# EasyEDA Pro project PWM.eprj

# Schematic Schematic1
Create Date: 2024-06-18; Page Name: P1; Project Name: PWM; Schematic Name: Schematic1; Update Date: 2024-06-20; Company: 嘉立创EDA; Page Size: A4; Version: V1.0
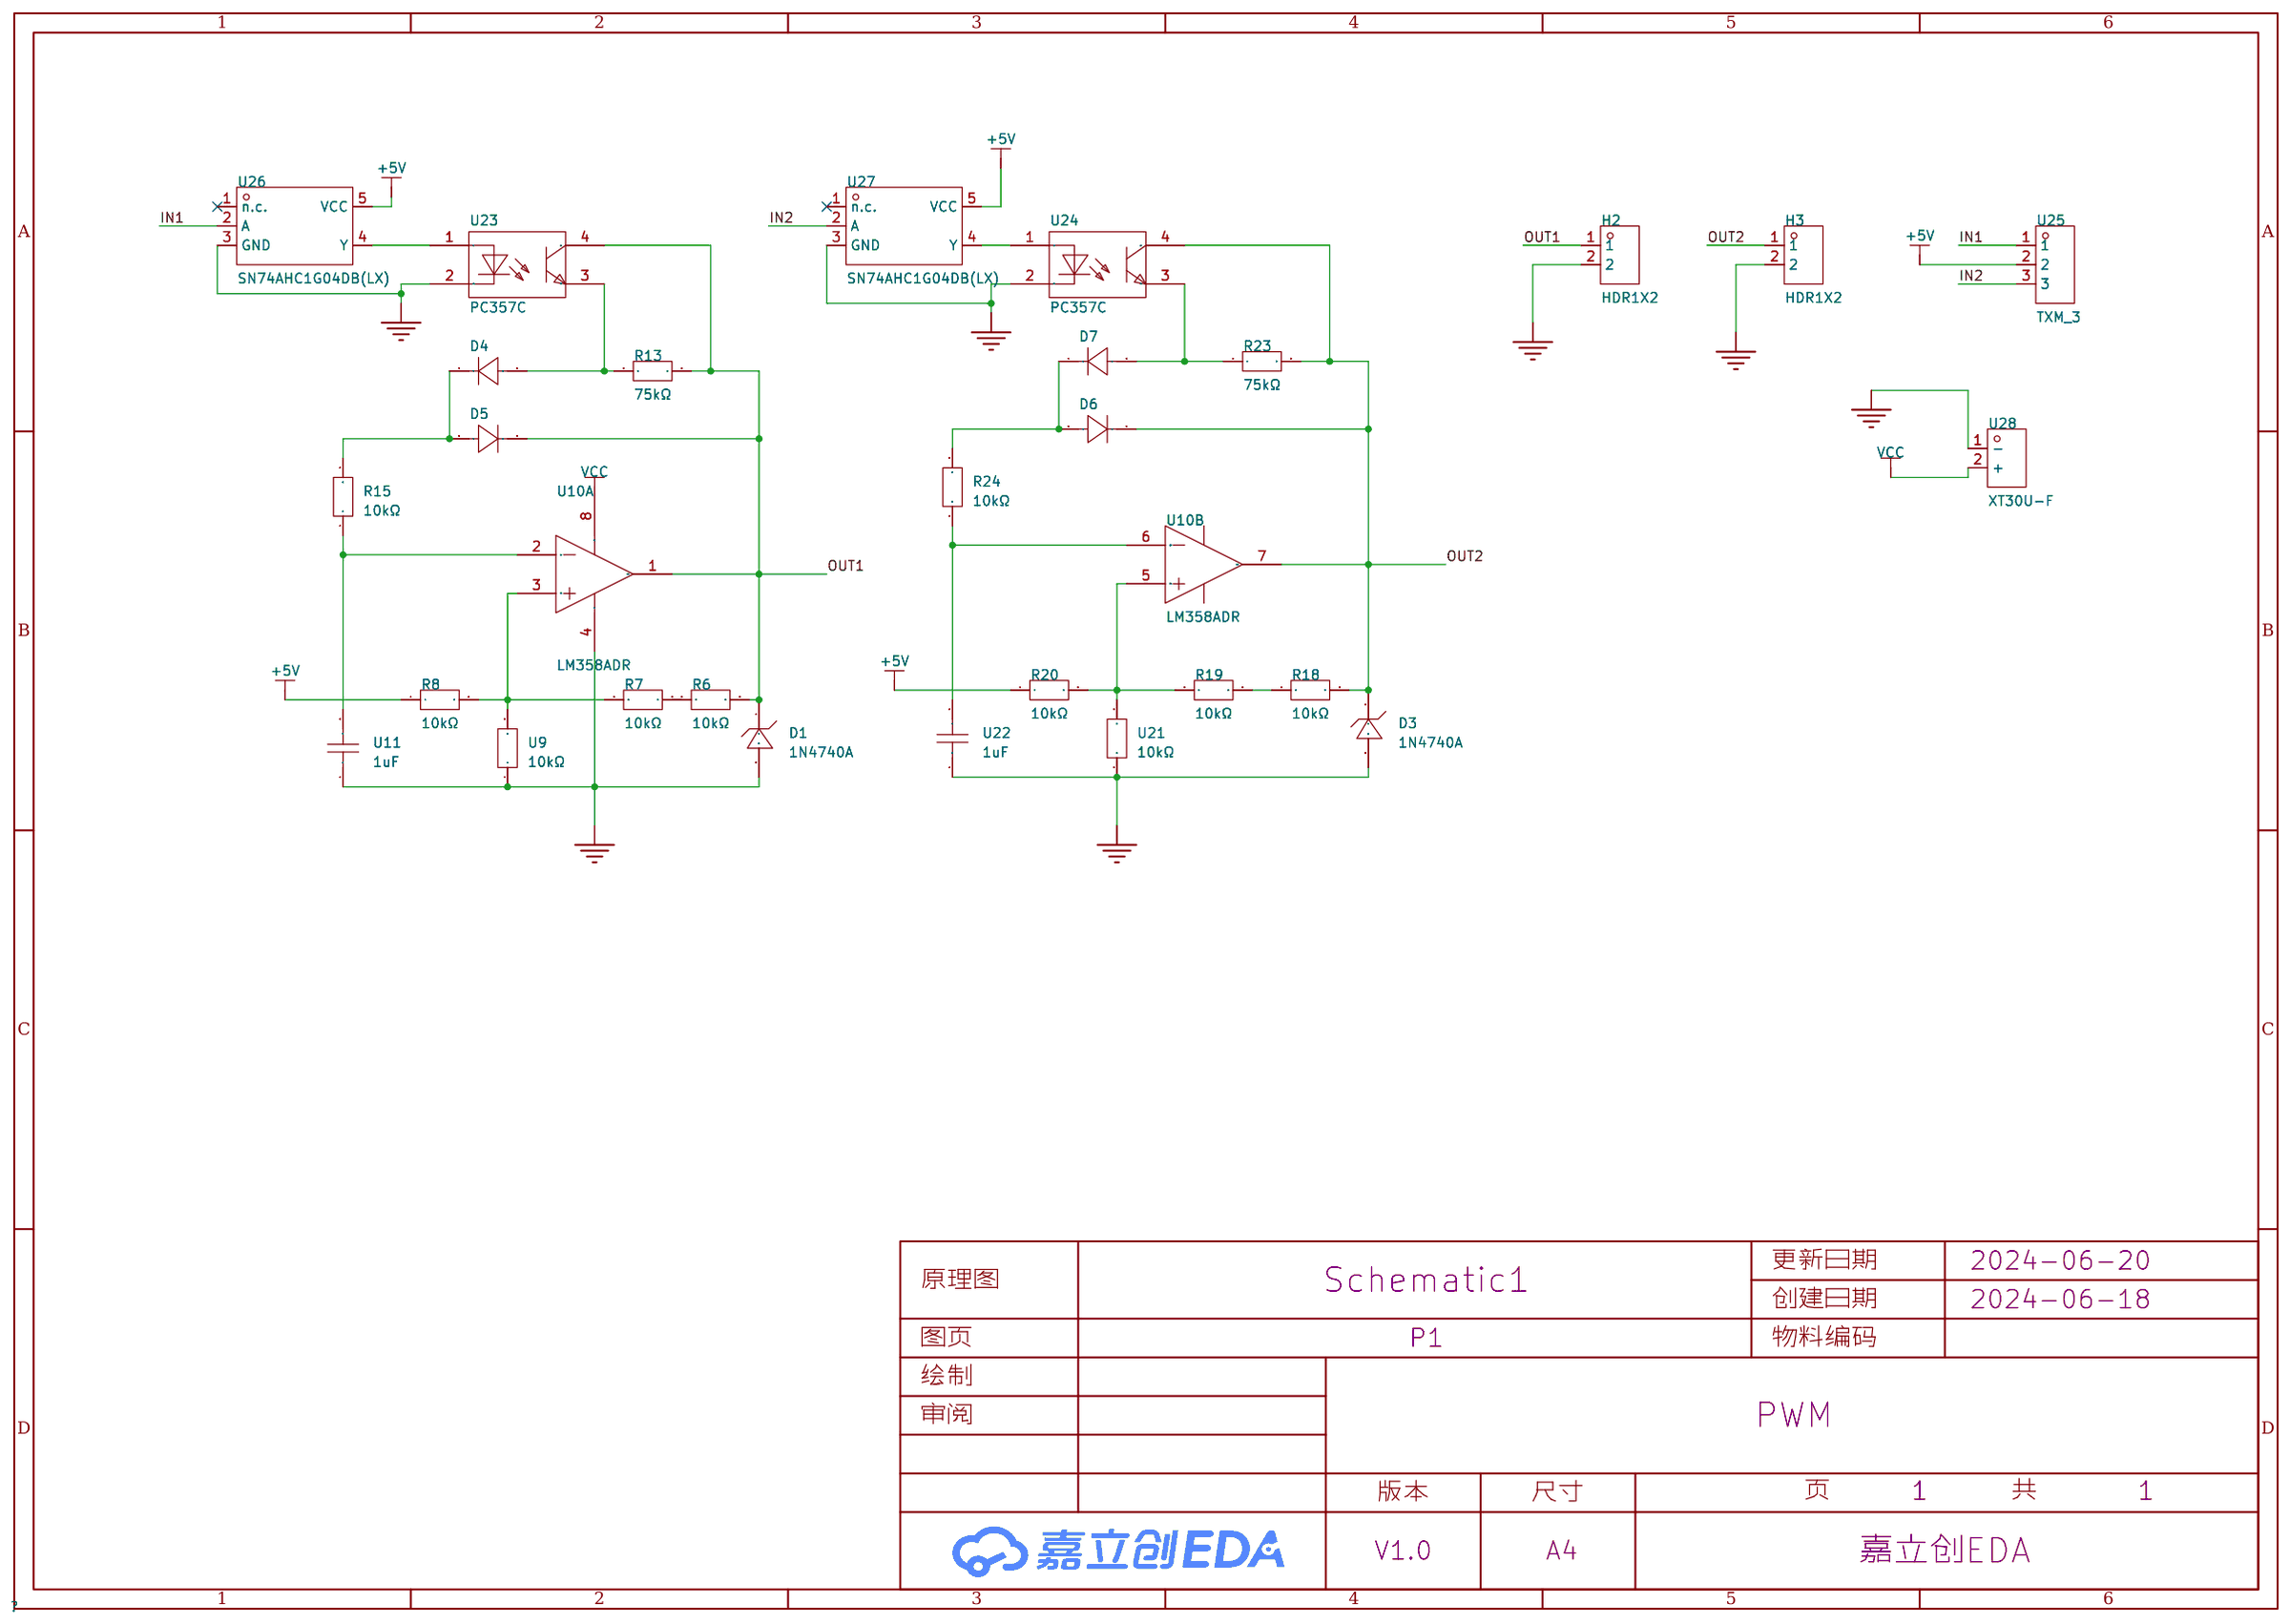
[diagram p0: schematic sheet]

## Parts
D1  1N4740A  [DO-41_BD2.4-L4.7-P8.70-D0.9-RD]
D3  1N4740A  [DO-41_BD2.4-L4.7-P8.70-D0.9-RD]
D4  -  [SMA_1N4007]
D5  -  [SMA_1N4007]
D6  -  [SMA_1N4007]
D7  -  [SMA_1N4007]
H2  HDR1X2  [HDR-TH_2P-P2.54-V-M-1]
H3  HDR1X2  [HDR-TH_2P-P2.54-V-M-1]
R6  10kΩ  [R0603]
R7  10kΩ  [R0603]
R8  10kΩ  [R0603]
R13  75kΩ  [R0805]
R15  10kΩ  [R0603]
R18  10kΩ  [R0603]
R19  10kΩ  [R0603]
R20  10kΩ  [R0603]
R23  75kΩ  [R0805]
R24  10kΩ  [R0603]
U9  10kΩ  [R0603]
U10  LM358ADR  [SOP-8_L4.9-W3.9-P1.27-LS6.0-BL]  (sections 1,2)
U11  1uF  [C0603]
U21  10kΩ  [R0603]
U22  1uF  [C0603]
U23  PC357C  [SOP-4_L4.6-W4.4-P2.54-LS7.0-TL]
U24  PC357C  [SOP-4_L4.6-W4.4-P2.54-LS7.0-TL]
U25  TXM_3  [HDR-TH_3P-P2.54-V-M-A]
U26  SN74AHC1G04DB(LX)  [SOT-23-5_L2.9-W1.6-P0.95-LS2.8-BR]
U27  SN74AHC1G04DB(LX)  [SOT-23-5_L2.9-W1.6-P0.95-LS2.8-BR]
U28  XT30U-F  [CONN-TH_XT30U-F]

## Library data of the parts
D1 D3 = 1N4740A: 二极管配置:独立式;稳压值(标称值):10V;功率(Pd):1W;; Supplier Part: C194121; Manufacturer: Multicomp; Supplier Footprint: DO-41; JLCPCB Part Class: 扩展库; Datasheet: https://atta.szlcsc.com/upload/public/pdf/source/20180713/C194121_FB04E48A62DB566CD3790F4CF10AE5FC.pdf; Supplier: LCSC; Diode Configuration: 独立式; Zener Voltage (Nom): 10V; Reverse Leakage Current (Ir): 10uA@7.6V; Power Dissipation: 1W; Zener Impedance (Zzt): 7Ω
D4-D7 = D_1N4007: Supplier Footprint: SMA
H2 H3 = HDR1X2: Supplier Part: C9900014921; Supplier Footprint: 排针; JLCPCB Part Class: 扩展库; Supplier: LCSC
R6-R8 R15 R18-R20 R24 U9 U21 = RCA0310KJLF: 阻值:10kΩ;精度:±5%;功率:100mW;; LCSC Part Name: 10kΩ ±5% 100mW; Supplier Part: C22369937; Manufacturer: HKR(香港电阻); Supplier Footprint: 0603; JLCPCB Part Class: 扩展库; Datasheet: https://atta.szlcsc.com/upload/public/pdf/source/20240327/626E23E3B2A799D2C85303DE2C37BB2A.pdf; Supplier: LCSC; Tolerance: ±5%; Power(Watts): 100mW
R13 R23 = WF08U7502DTL: 电阻类型:薄膜电阻;阻值:75kΩ;精度:±0.5%;功率:100mW;最大工作电压:100V;温度系数:±25ppm/℃;; LCSC Part Name: 薄膜电阻 75kΩ ±0.5% 100mW; Supplier Part: C880790; Manufacturer: Walsin(华新科); Supplier Footprint: 0805; JLCPCB Part Class: 扩展库; Datasheet: https://atta.szlcsc.com/upload/public/pdf/source/20180929/C305266_98C90C4B86D2D931B3D034C2E9BEFC81.pdf; Supplier: LCSC; Type: 薄膜电阻; Tolerance: ±0.5%; Power(Watts): 100mW; Overload Voltage (Max): 100V; Temperature Coefficient: ±25ppm/℃; Operating Temperature Range: -55℃~+155℃
U10 = LM358ADR_C404320: 放大器数:-;; Supplier Part: C404320; Manufacturer: UMW(友台半导体); Supplier Footprint: SOP-8; JLCPCB Part Class: 扩展库; Datasheet: https://atta.szlcsc.com/upload/public/pdf/source/20231109/C087AE3C5A972B772B4D5C149AD53864.pdf; Supplier: LCSC
U11 U22 = HGC0603R5105K250NTHJ: 容值:1uF;精度:±10%;额定电压:25V;材质(温度系数):X5R;; LCSC Part Name: 1uF ±10% 25V; Supplier Part: C7432766; Manufacturer: Chinocera(华瓷); Supplier Footprint: 0603; Datasheet: https://atta.szlcsc.com/upload/public/pdf/source/20240320/FAC3FEC40A78BC5CCCE96C232A94D860.pdf; Supplier: LCSC; Tolerance: ±10%; Voltage Rated: 25V; Temperature Coefficient: X5R
U23 U24 = PC357C_1: 输入电压类型:DC;正向电压:1.4V;输出电流:50mA;隔离电压(rms):3.75kV;反向电压:6V;输出通道数:1;集射极饱和电压(Vce(sat)@Ic,IF):200mV@1mA,20mA;; LCSC Part Name: 光耦-光电晶体管输出; Supplier Part: C20612582; Manufacturer: AOTE(奥特); Supplier Footprint: SOP-4; JLCPCB Part Class: 扩展库; Datasheet: https://atta.szlcsc.com/upload/public/pdf/source/20240430/5A81F6B402555EE96B4DF8FFE69D8124.pdf; Supplier: LCSC; Input voltage type: DC; Forward Voltage: 1.4V; Output Current: 50mA; Isolation Voltage(rms): 3.75kV; Reverse Voltage: 6V; Number of Outputs: 1; Collector-Emitter Saturation Voltage (Vce(sat)@Ic,IF): 200mV@1mA,20mA; Operating Temperature: -55℃~+100℃
U25 = TXM_3: Supplier Part: C9900014923; Supplier Footprint: 排针; JLCPCB Part Class: 扩展库; Supplier: LCSC
U26 U27 = SN74AHC1G04DB(LX): 电源电压:2V~5.5V;供电电流(最大值):1uA;电路数:1;最大传播延迟(tpd):7.5ns@5.5V,50pF;; LCSC Part Name: 集成电路; Supplier Part: C22384791; Manufacturer: LX(灵星芯微); Supplier Footprint: SOT-23-5; Datasheet: https://atta.szlcsc.com/upload/public/pdf/source/20240417/EB39B72976109D8FD4B2BA0D56E9CF3F.pdf; Supplier: LCSC; Supply Voltage(Single): 2V~5.5V; Supply Current (Max): 1uA; Number of Circuits: 1; Sink Current: 8mA; Source Current: 8mA; High level range (VIH): 1.5V~3.85V; Low level range (VIL): 500mV~1.65V; High level range (VOH): 1.9V~4.5V; Low level range (VOL): 100mV~360mV; Max Propagation Delay: 7.5ns@5.5V,50pF; Series: 74AHC系列; Operating Temperature: -40℃~+125℃
U28 = XT30U-F: 类别:-;类型1:-;; LCSC Part Name: AMASS(艾迈斯)轻量版锂电池插头母头 XT30U-F; Supplier Part: C99102; Manufacturer: AMASS(艾迈斯); JLCPCB Part Class: 扩展库; Datasheet: https://atta.szlcsc.com/upload/public/pdf/source/20190916/C428721_B0ECB8C5937139CEFE8736D2D3175B0E.pdf; Supplier: LCSC; Brand: 艾迈斯; Type: 插头; Colour: 黄色; InterfaceType: 母头

## Nets
+5V: R8.1 R20.1 U25.2 U26.5(VCC) U27.5(VCC)
GND: D1.2 D3.2 H2.2 H3.2 U9.1 U10.4(-V) U11.1 U21.1 U22.1 U23.2(CAT) U24.2(CAT) U26.3(GND) U27.3(GND) U28.1(-)
VCC: U10.8(+V) U28.2(+)
IN1: U25.1 U26.2(A)
IN2: U25.3 U27.2(A)
OUT1: D1.1 D5.1(K) H2.1 R6.2 R13.2 U10.1(OUT A) U23.4(COL)
OUT2: D3.1 D6.1(K) H3.1 R18.2 R23.2 U10.7(OUT B) U24.4(COL)
$1N1467: R6.1 R7.2
$1N1677: D4.1(K) D5.2(A) R15.2
$1N1702: R15.1 U10.2(-IN A) U11.2
$1N2156: R18.1 R19.2
$1N2172: D6.2(A) D7.1(K) R24.2
$1N2176: R24.1 U10.6(-IN B) U22.2
$1N3269: D7.2(A) R23.1 U24.3(EM)
$1N3293: D4.2(A) R13.1 U23.3(EM)
$1N4036: R7.1 R8.2 U9.2 U10.3(+IN A)
$1N4061: R19.1 R20.2 U10.5(+IN B) U21.2
$1N4283: U23.1(AN) U26.4(Y)
$1N4351: U24.1(AN) U27.4(Y)

Not connected (* = marked no-connect by the designer): U26 1(n.c.)*; U27 1(n.c.)*

# Board PCB1
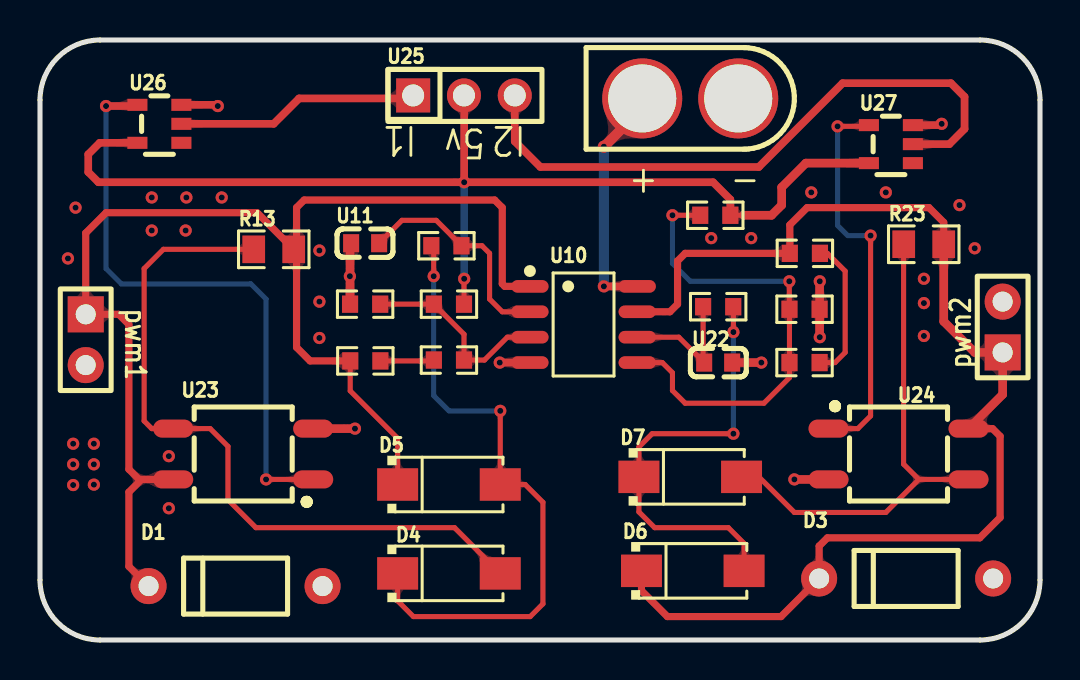
[diagram p1: board, top side]
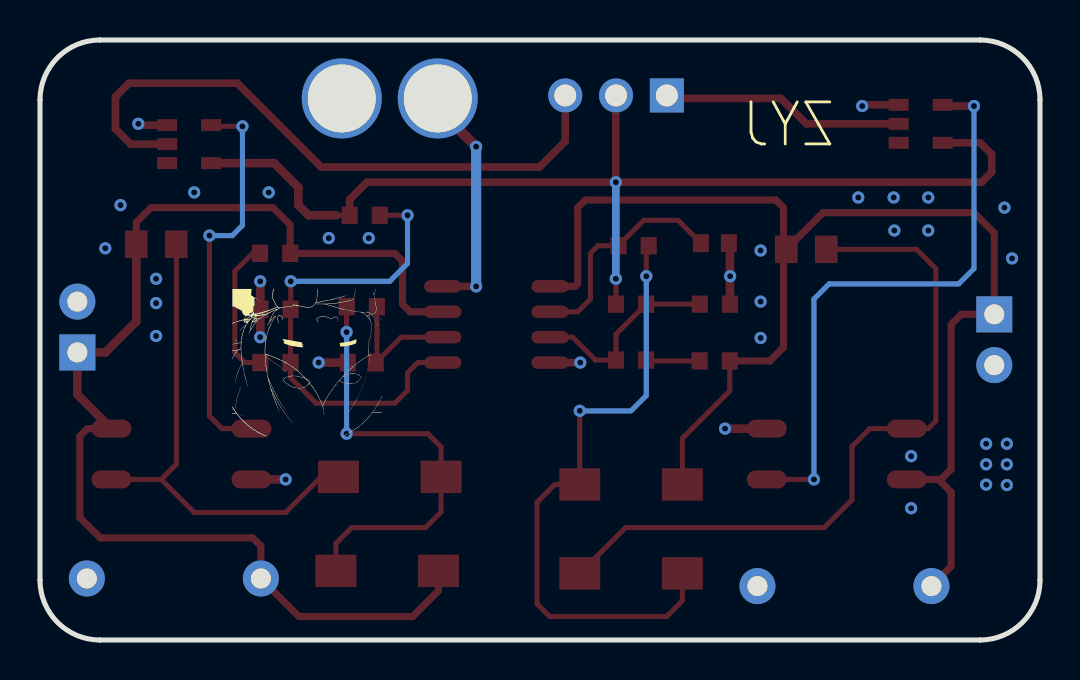
[diagram p2: board, bottom side, seen from below]

Outline 50 x 30 mm; copper layers: Top Layer, Bottom Layer. Coordinates in mm from the lower left corner of the outline.
Outline path: 0,27 0,3 arc(0.88,0.88) 3,0 47,0 arc(49.12,0.88) 50,3 50,27 arc(49.12,29.12) 47,30 3,30 arc(0.88,29.12) 0,27
Stack: Top Layer 0.035mm / Dielectric1 1.51mm FR4 er 4.5 / Bottom Layer 0.035mm

## Design rules (mm)
template: JLCPCB Capability(Two Layers Board)
spacing copperThickness1oz (default): track to track 0.102, other pairs 0.152 to 0.3
spacing copperThickness2oz: track to track 0.203, other pairs 0.152 to 0.3
track width copperThickness1oz (default): min 0.127, default 0.254, max 2.54
track width copperThickness2oz: min 0.203, default 0.254, max 2.54
differential pair differentialPair (default): width min 0.127, default 0.254, max 2.54; gap min 0.152, default 0.152
via viaSize (default): diameter min 0.5, default 0.61, max 10; hole min 0.3, default 0.305, max 6.3

## Placement (name value [footprint] x y rotation side)
D1  1N4740A  [DO-41_BD2.4-L4.7-P8.70-D0.9-RD]  9.78 2.69 0 top
D3  1N4740A  [DO-41_BD2.4-L4.7-P8.70-D0.9-RD]  43.31 3.08 0 top
D4  -  [SMA_1N4007]  20.45 3.33 0 top
D5  -  [SMA_1N4007]  20.45 7.77 0 top
D6  -  [SMA_1N4007]  32.64 3.46 0 top
D7  -  [SMA_1N4007]  32.51 8.16 0 top
H2  HDR1X2  [HDR-TH_2P-P2.54-V-M-1]  2.29 15.01 270 top
H3  HDR1X2  [HDR-TH_2P-P2.54-V-M-1]  48.13 15.65 90 top
R6  10kΩ  [R0603]  16.27 13.95 180 top
R7  10kΩ  [R0603]  20.45 14 180 top
R8  10kΩ  [R0603]  20.45 16.79 180 top
R13  75kΩ  [R0805]  11.69 19.53 0 top
R15  10kΩ  [R0603]  20.32 19.71 180 top
R18  10kΩ  [R0603]  38.24 19.33 180 top
R19  10kΩ  [R0603]  38.23 13.87 0 top
R20  10kΩ  [R0603]  33.76 21.24 180 top
R23  75kΩ  [R0805]  44.19 19.79 0 top
R24  10kΩ  [R0603]  33.91 16.66 0 top
U9  10kΩ  [R0603]  16.26 16.79 0 top
U10  LM358ADR  [SOP-8_L4.9-W3.9-P1.27-LS6.0-BL]  27.18 15.78 270 top
U11  1uF  [C0603]  16.26 19.84 0 top
U21  10kΩ  [R0603]  38.23 16.54 180 top
U22  1uF  [C0603]  33.91 13.87 180 top
U23  PC357C  [SOP-4_L4.6-W4.4-P2.54-LS7.0-TL]  10.16 9.3 180 top
U24  PC357C  [SOP-4_L4.6-W4.4-P2.54-LS7.0-TL]  42.93 9.3 0 top
U25  TXM_3  [HDR-TH_3P-P2.54-V-M-A]  21.2 27.23 0 top
U26  SN74AHC1G04DB(LX)  [SOT-23-5_L2.9-W1.6-P0.95-LS2.8-BR]  5.97 25.81 0 top
U27  SN74AHC1G04DB(LX)  [SOT-23-5_L2.9-W1.6-P0.95-LS2.8-BR]  42.55 24.79 0 top
U28  XT30U-F  [CONN-TH_XT30U-F]  32.51 27.08 0 top

## Footprints (pads in the part's own frame, mm; a bottom-side part is the same pattern mirrored in y, then rotated)
C0603
  rect 0.8x0.9 smd: 1(-0.7,0) 2(0.7,0)
CONN-TH_XT30U-F
  round 4 hole 3.4: 1(2.4,0) 2(-2.4,0)
DO-41_BD2.4-L4.7-P8.70-D0.9-RD
  round 1.8 hole 1: 1(-4.35,0) 2(4.35,0)
HDR-TH_2P-P2.54-V-M-1
  rect 1.8x1.8 hole 1: 1(-1.27,0)
  round 1.8 hole 1: 2(1.27,0)
HDR-TH_3P-P2.54-V-M-A
  rect 1.7x1.7 hole 1.1: 1(-2.54,0)
  round 1.7 hole 1.1: 2(0,0) 3(2.54,0)
R0603
  rect 0.806x0.864 smd: 1(-0.753,0) 2(0.753,0)
R0805
  rect 1.133x1.377 smd: 1(-1,0) 2(1,0)
SMA_1N4007
  rect 2.046x1.62 smd: 1(-2.566,0) 2(2.566,0)
SOP-4_L4.6-W4.4-P2.54-LS7.0-TL
  oval 2x0.9 smd: 1(-3.5,1.27) 2(-3.5,-1.27) 3(3.5,-1.27) 4(3.5,1.27)
SOP-8_L4.9-W3.9-P1.27-LS6.0-BL
  oval 0.63x1.865 smd: 1(-1.905,-2.683) 2(-0.635,-2.683) 3(0.635,-2.683) 4(1.905,-2.683) 5(1.905,2.683) 6(0.635,2.683) 7(-0.635,2.683) 8(-1.905,2.683)
SOT-23-5_L2.9-W1.6-P0.95-LS2.8-BR
  rect 1x0.6 smd: 1(1.1,-0.95) 2(1.1,0) 3(1.1,0.95) 4(-1.1,0.95) 5(-1.1,-0.95)

## Nets
As in the schematic.

Pads without a net: U26 1; U27 1

## Via types
v1: diameter 0.61, hole 0.305, Top Layer to Bottom Layer, 50 vias

## Routing (per net, layer and track width the routed paths; a pad name or vN(x,y) marks a point on that pad's centre or on a via; arc(x,y) is an arc through that point)
+5V: length 56
  Top Layer w0.254: R20.1 35.18,21.24 ; R8.1 21.2,18.06 v1(21.21,18.06)
  Top Layer w0.381: U25.2 21.21,27.22 v1(21.21,22.89) ; v1(21.21,22.89) 33.66,22.89 34.52,22.02 R20.1 ; v1(21.21,22.89) 2.92,22.89 2.41,23.4 2.41,24.28 2.99,24.86 U26.5
  Top Layer w0.432: 41.44,23.84 38.29,23.84 37.08,22.63 37.08,21.75 36.58,21.24 35.18,21.24
  Bottom Layer w0.381: v1(21.21,18.06) v1(21.21,22.89)
GND: length 15.9
  Top Layer w0.381: v1(8.89,26.7) 8.83,26.76 U26.3 ; v1(45.09,25.81) 45.02,25.74 U27.3 ; v1(22.99,13.87) U10.4
  Top Layer w0.432: v1(38.99,15.14) 38.98,15.15 U21.1 38.98,17.93 v1(38.99,17.94) ; U23.2 v1(15.75,10.57) ; U24.2 v1(37.72,8.03) ; U9.1 15.5,19.79 U11.1 ; U22.1 v1(36.07,13.87)
  vias: v1(1.4,19.08) v1(1.66,9.81) v1(1.66,8.78) v1(1.66,7.75) v1(1.78,21.62) v1(2.69,9.81) v1(2.69,8.78) v1(2.69,7.77) v1(5.59,22.13) v1(5.59,20.47) v1(6.44,9.19) v1(6.44,6.59) v1(7.32,22.13) v1(7.28,20.47) v1(9.09,22.13) v1(13.97,19.47) v1(13.97,16.92) v1(13.97,15.1) v1(15.49,18.19) v1(33.56,20.09) v1(35.56,20.09) v1(38.56,22.38) v1(42.29,22.38) v1(44.2,18.06) v1(44.2,16.84) v1(44.2,15.2) v1(45.97,21.75) v1(46.74,19.59)
VCC: length 11.9
  Top Layer w0.381: v1(28.19,17.68) U10.8
  Top Layer w0.508: U28.2 30.11,26.58 v1(28.19,24.67)
  Bottom Layer w0.508: v1(28.19,24.67) v1(28.19,17.68)
IN1: length 12.2
  Top Layer w0.381: U26.2 11.68,25.81 12.95,27.08 18.51,27.08 U25.1
IN2: length 31.8
  Top Layer w0.381: U27.2 45.47,24.79 46.23,25.55 46.23,27.16 45.55,27.84 40.13,27.84 35.94,23.65 25.02,23.65 23.74,24.93 U25.3
OUT1: length 66.8
  Top Layer w0.254: D5.1 17.88,10.09 15.51,12.46 R6.2
  Top Layer w0.355: 5.08,8.03 4.95,8.03 4.44,8.54 4.44,15.78 3.94,16.28 H2.1 2.29,20.35 3.3,21.36 10.86,21.36 R13.2 ; 5.08,8.03 U23.4 ; 5.08,8.03 4.44,7.39 4.44,3.68 D1.1 ; R13.2 12.83,19.67 12.83,21.62 13.21,22 22.73,22 23.11,21.62 23.11,17.81 23.24,17.68 U10.1 ; R13.2 12.83,19.39 12.83,14.63 13.51,13.95 R6.2
OUT2: length 61.2
  Top Layer w0.355: U10.7 31.5,16.41 31.88,16.79 31.88,18.95 32.26,19.33 R18.2 37.49,20.75 38.35,21.62 44.45,21.62 45.19,20.88 R23.2 ; U24.4 47.62,10.57 48.01,10.19 48.01,6.12 46.99,5.11 39.37,5.11 38.96,4.69 38.96,3.08 37.05,1.17 31.37,1.17 30.07,2.47 D6.1
  Top Layer w0.432: U24.4 48.13,12.28 H3.1 46.74,14.38 45.19,15.93 R23.2
$1N1467: length 2.7
  Top Layer w0.254: R6.1 19.65,13.95 R7.2
$1N1677: length 31.7
  Top Layer w0.254: D4.1 17.88,1.96 18.67,1.17 24.51,1.17 25.15,1.81 25.15,6.89 24.26,7.77 D5.2 v1(23.01,11.46) ; v1(19.69,18.19) 19.69,19.59 R15.2
  Bottom Layer w0.254: v1(19.69,18.19) 19.69,12.22 20.45,11.46 v1(23.01,11.46)
$1N1702: length 11.2
  Top Layer w0.254: U10.2 23.11,16.41 22.48,17.05 22.48,19.33 22.1,19.71 R15.1 21.07,19.72 19.81,20.98 18.1,20.98 16.98,19.87
$1N2156: length 7.2
  Top Layer w0.254: R19.2 39.75,13.87 40.26,14.38 40.26,18.44 39.37,19.33 R18.1
$1N2172: length 21.9
  Top Layer w0.254: v1(34.67,10.31) 30.61,10.31 29.95,9.65 D7.1 29.95,6.4 30.73,5.62 34.42,5.62 35.2,4.83 D6.2 ; v1(34.67,15.39) 34.67,16.66 R24.2
  Bottom Layer w0.254: v1(34.67,10.31) v1(34.67,15.39)
$1N2176: length 6.6
  Top Layer w0.254: U10.6 31.94,15.14 33.16,13.92 ; 33.16,13.92 R24.1 ; 33.16,13.92 U22.2
$1N3269: length 24.8
  Top Layer w0.254: U24.3 43.94,8.03 ; 43.94,8.03 42.29,6.38 37.72,6.38 35.94,8.16 D7.2 ; 43.94,8.03 43.18,8.79 43.18,19.78 R23.1
$1N3293: length 36
  Top Layer w0.254: D4.2 20.73,5.62 10.8,5.62 9.4,7.01 9.4,9.68 8.51,10.57 U23.3 5.59,10.57 5.21,10.95 5.21,18.57 6.17,19.53 R13.1
$1N4036: length 9.9
  Top Layer w0.254: U9.2 R8.2 21.2,15.29 R7.1 22.22,14 23.37,15.14 U10.3
$1N4061: length 24.3
  Top Layer w0.254: v1(37.47,17.94) 37.47,16.55 U21.2 R19.1 37.47,13.12 36.19,11.84 32.26,11.84 31.62,12.47 31.62,13.36 31.12,13.87 U10.5 ; v1(31.62,21.24) R20.2
  Bottom Layer w0.254: v1(37.47,17.94) 32.51,17.94 31.62,18.82 v1(31.62,21.24)
$1N4283: length 29.7
  Top Layer w0.254: U23.1 v1(11.3,8.03)
  Top Layer w0.381: v1(3.3,26.7) 4.81,26.7 U26.4
  Bottom Layer w0.254: v1(3.3,26.7) 3.3,18.57 4.06,17.81 10.54,17.81 11.3,17.05 v1(11.3,8.03)
$1N4351: length 19.8
  Top Layer w0.254: v1(41.53,20.22) 41.53,11.2 40.89,10.57 U24.1 ; 41.44,25.74 41.38,25.68 v1(39.88,25.68)
  Bottom Layer w0.254: v1(39.88,25.68) 39.88,20.73 40.39,20.22 v1(41.53,20.22)

## Copper pours and planes (outline as drawn; the poured copper is in the pictures)
GND on Bottom Layer: -4.83,36.6 56.52,36.6 56.52,-6.58 -4.83,-6.58

Small or netless copper shapes (teardrops, artwork), in the pictures only: 132 on Top Layer, 14 on Bottom Layer

## Text on the board
Bottom Silkscreen Layer: ZYJ
Top Silkscreen Layer: pwm2 | pwm1 | + | - | I1 | 5v | I2
